# Altium schematic sheet Sheet1.SchDoc
size A4
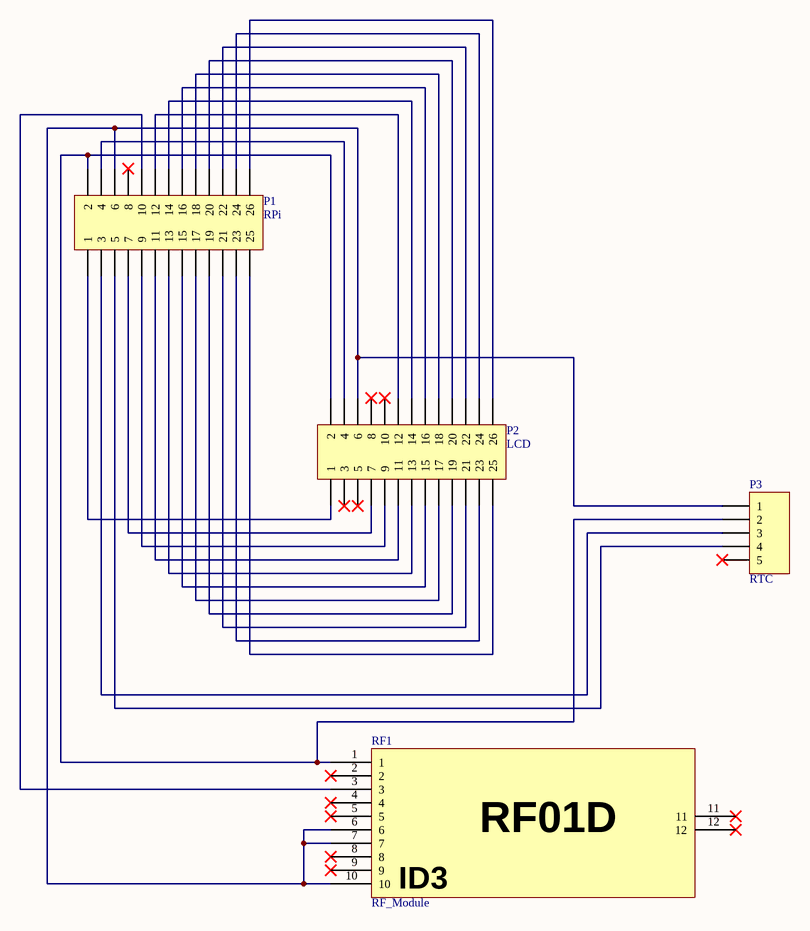
[diagram p0: Sheet1.SchDoc]

## Parts
P1  RPi  [HDR2X13]
P2  LCD  [HDR2X13]
P3  RTC  [HDR1X5]
RF1  RF_Module  [PCBComponent_1]

## Nets
NetP1_1: P1.1 P2.1
NetP1_2: P1.2 P2.2 P3.2 RF1.1
NetP1_3: P1.3 P3.3
NetP1_4: P1.4 P2.4
NetP1_5: P1.5 P3.4
NetP1_6: P1.6 P2.6 P3.1 RF1.6 RF1.7 RF1.10
NetP1_7: P1.7 P2.7
NetP1_9: P1.9 P2.9
NetP1_10: P1.10 RF1.3
NetP1_11: P1.11 P2.11
NetP1_12: P1.12 P2.12
NetP1_13: P1.13 P2.13
NetP1_14: P1.14 P2.14
NetP1_15: P1.15 P2.15
NetP1_16: P1.16 P2.16
NetP1_17: P1.17 P2.17
NetP1_18: P1.18 P2.18
NetP1_19: P1.19 P2.19
NetP1_20: P1.20 P2.20
NetP1_21: P1.21 P2.21
NetP1_22: P1.22 P2.22
NetP1_23: P1.23 P2.23
NetP1_24: P1.24 P2.24
NetP1_25: P1.25 P2.25
NetP1_26: P1.26 P2.26

Not connected (* = marked no-connect by the designer): P1 8*; P2 3* 5* 8* 10*; P3 5*; RF1 2* 4* 5* 8* 9* 11* 12*

## Notes on the sheet
- (in symbol Component_1) RF01D; ID3

## Library data of the parts
P1 P2 = Header 13X2: Header, 13-Pin, Dual row; LatestRevisionDate: 17-Jul-2002; LatestRevisionNote: Re-released for DXP Platform.; Publisher: Altium Limited
P3 = Header 5: Header, 5-Pin; LatestRevisionDate: 17-Jul-2002; LatestRevisionNote: Re-released for DXP Platform.; Publisher: Altium Limited
RF1 = Component_1